# Altium schematic sheet ART-Pi_H750_Peripherals.SchDoc: STM32H750XB_Peripherals
size A3; DocumentNumber: 6; Revision: V1.5; SheetNumber: 6; SheetTotal: 11; PageSetup: Record=PageOptions|CenterHorizontal=True|CenterVertical=True|PrintScale=1.01|XCorrection=1.00|YCorrection=1.00|PrintKind=0|BorderSize=5000000|LeftOffset=0|BottomOffset=0|Orientation=2|PaperLength=1000|PaperWidth=1000|Scale=100|PaperSource=7|PrintQuality=600|MediaType=1|DitherType=10|PrintScaleMode=1|PaperKind=A3(297x420mm)|PaperIndex=8
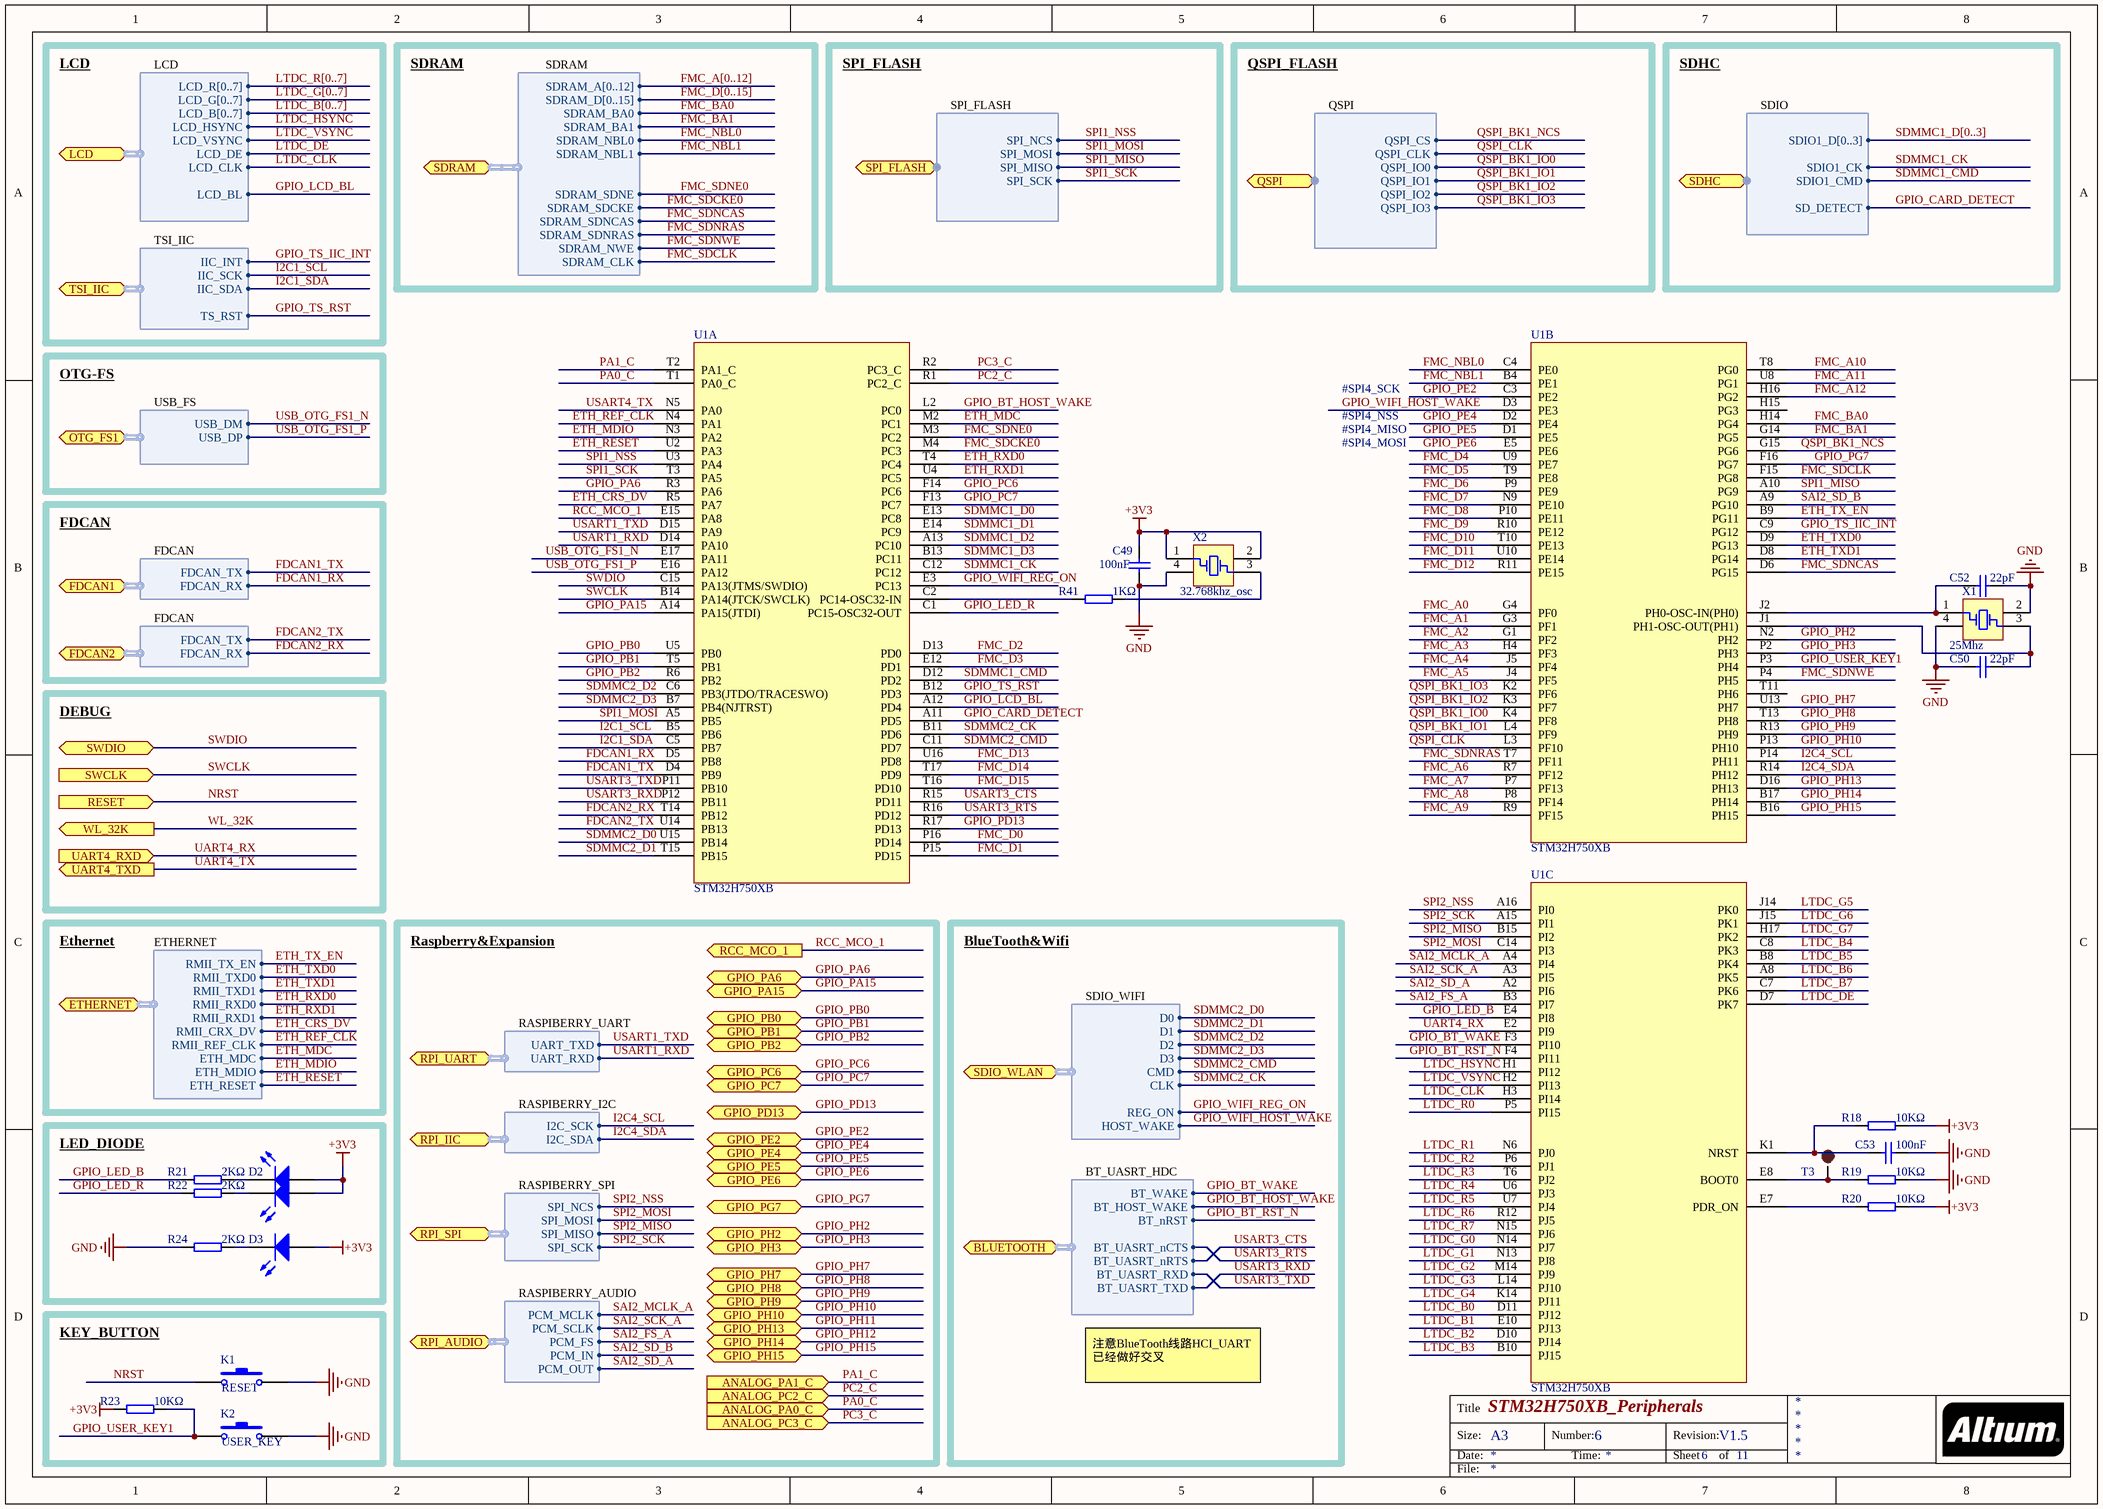
[diagram p0: ART-Pi_H750_Peripherals.SchDoc]

## Parts
C49  100nF  [0402_C]
C50  22pF  [0402_C]
C52  22pF  [0402_C]
C53  100nF  [0402_C]
D2  LED2  [LED2-0603]  (value not drawn)
D3  LED  [0603_LED]  (value not drawn)
K1  RESET  [SW-SMD]
K2  USER_KEY  [SW-SMD]
R18  10KΩ  [0402_R]
R19  10KΩ  [0402_R]
R20  10KΩ  [0402_R]
R21  2KΩ  [0402_R]
R22  2KΩ  [0402_R]
R23  10KΩ  [0402_R]
R24  2KΩ  [0402_R]
R41  1KΩ  [0402_R]
T3  TEST POINT  [Test_Point]  (value not drawn)
U1  STM32H750XB  [TFBGA240+25]  (parts A,B,C of 4)
X1  25Mhz  [SMD2520]
X2  32.768khz_osc  [SMD2520]

## Blocks framed on the sheet
LED_DIODE: D2 D3 R21 R22 R24
KEY_BUTTON: K1 K2 R23

## Ports
ANALOG_PA0_C (in), ANALOG_PA1_C (in), ANALOG_PC2_C (in), ANALOG_PC3_C (in), BLUETOOTH (harness Harness), ETHERNET (harness Harness), FDCAN1 (harness Harness), FDCAN2 (harness Harness), GPIO_PA6 (bidir), GPIO_PA15 (bidir), GPIO_PB0 (bidir), GPIO_PB1 (bidir), GPIO_PB2 (bidir), GPIO_PC6 (bidir), GPIO_PC7 (bidir), GPIO_PD13 (bidir), GPIO_PE2 (bidir), GPIO_PE4 (bidir), GPIO_PE5 (bidir), GPIO_PE6 (bidir), GPIO_PG7 (bidir), GPIO_PH2 (bidir), GPIO_PH3 (bidir), GPIO_PH7 (bidir), GPIO_PH8 (bidir), GPIO_PH9 (bidir), GPIO_PH10 (bidir), GPIO_PH13 (bidir), GPIO_PH14 (bidir), GPIO_PH15 (bidir), LCD (harness Harness), OTG_FS1 (harness Harness), QSPI (harness Harness), RCC_MCO_1 (out), RESET (in), RPI_AUDIO (harness Harness), RPI_IIC (harness Harness), RPI_SPI (harness Harness), RPI_UART (harness Harness), SDHC (harness Harness), SDIO_WLAN (harness Harness), SDRAM (harness Harness), SPI_FLASH (harness Harness), SWCLK (in), SWDIO (bidir), TSI_IIC (harness Harness), UART4_RXD (in), UART4_TXD (out), WL_32K (out)

## Harnesses
Harness: IIC_INT, IIC_SCK, IIC_SDA, TS_RST
Harness: LCD_G[0..7], LCD_B[0..7], LCD_HSYNC, LCD_VSYNC, LCD_DE, LCD_CLK, LCD_BL, LCD_R[0..7]
Harness: SDRAM_A[0..12], SDRAM_D[0..15], SDRAM_BA0, SDRAM_BA1, SDRAM_NBL0, SDRAM_NBL1, SDRAM_SDNE, SDRAM_SDCKE, SDRAM_SDNCAS, SDRAM_SDNRAS, SDRAM_NWE, SDRAM_CLK
Harness: SPI_NCS, SPI_MOSI, SPI_MISO, SPI_SCK
Harness: QSPI_CS, QSPI_CLK, QSPI_IO0, QSPI_IO1, QSPI_IO2, QSPI_IO3
Harness: SD_DETECT, SDIO1_D[0..3], SDIO1_CMD, SDIO1_CK
Harness: USB_DM, USB_DP
Harness: FDCAN_TX, FDCAN_RX
Harness: RMII_TX_EN, RMII_TXD0, RMII_TXD1, RMII_RXD0, RMII_RXD1, RMII_CRX_DV, RMII_REF_CLK, ETH_MDC, ETH_MDIO, ETH_RESET
Harness: UART_TXD, UART_RXD
Harness: I2C_SCK, I2C_SDA
Harness: PCM_MCLK, PCM_SCLK, PCM_FS, PCM_IN, PCM_OUT
Harness: D0, D1, D2, D3, CMD, CLK, REG_ON, HOST_WAKE
Harness: BT_WAKE, BT_HOST_WAKE, BT_nRST, BT_UASRT_nCTS, BT_UASRT_nRTS, BT_UASRT_RXD, BT_UASRT_TXD

## Nets
+3V3: C49.2 D2.1 D2.4 D3.1(A) R18.1 R20.1 R23.2 X2.1(OSC1) X2.2(OSC2)
GND: C49.1 C50.2 C52.1 C53.1 K1.2 K2.2 R19.1 R24.2 X1.2(OSC2) X1.4 X2.4
ETH_CRS_DV: U1.R5(PA7) ; port ETHERNET.RMII_CRX_DV
ETH_MDC: U1.M2(PC1) ; port ETHERNET.ETH_MDC
ETH_MDIO: U1.N3(PA2) ; port ETHERNET.ETH_MDIO
ETH_REF_CLK: U1.N4(PA1) ; port ETHERNET.RMII_REF_CLK
ETH_RESET: U1.U2(PA3) ; port ETHERNET.ETH_RESET
ETH_RXD0: U1.T4(PC4) ; port ETHERNET.RMII_RXD0
ETH_RXD1: U1.U4(PC5) ; port ETHERNET.RMII_RXD1
ETH_TX_EN: U1.B9(PG11) ; port ETHERNET.RMII_TX_EN
ETH_TXD0: U1.D9(PG13) ; port ETHERNET.RMII_TXD0
ETH_TXD1: U1.D8(PG14) ; port ETHERNET.RMII_TXD1
FDCAN1_RX: U1.D5(PB8) ; port FDCAN1.FDCAN_RX
FDCAN1_TX: U1.D4(PB9) ; port FDCAN1.FDCAN_TX
FDCAN2_RX: U1.T14(PB12) ; port FDCAN2.FDCAN_RX
FDCAN2_TX: U1.U14(PB13) ; port FDCAN2.FDCAN_TX
FMC_A0: U1.G4(PF0)
FMC_A1: U1.G3(PF1)
FMC_A2: U1.G1(PF2)
FMC_A3: U1.H4(PF3)
FMC_A4: U1.J5(PF4)
FMC_A5: U1.J4(PF5)
FMC_A6: U1.R7(PF12)
FMC_A7: U1.P7(PF13)
FMC_A8: U1.P8(PF14)
FMC_A9: U1.R9(PF15)
FMC_A10: U1.T8(PG0)
FMC_A11: U1.U8(PG1)
FMC_A12: U1.H16(PG2)
FMC_BA0: U1.H14(PG4) ; port SDRAM.SDRAM_BA0
FMC_BA1: U1.G14(PG5) ; port SDRAM.SDRAM_BA1
FMC_D0: U1.P16(PD14)
FMC_D1: U1.P15(PD15)
FMC_D2: U1.D13(PD0)
FMC_D3: U1.E12(PD1)
FMC_D4: U1.U9(PE7)
FMC_D5: U1.T9(PE8)
FMC_D6: U1.P9(PE9)
FMC_D7: U1.N9(PE10)
FMC_D8: U1.P10(PE11)
FMC_D9: U1.R10(PE12)
FMC_D10: U1.T10(PE13)
FMC_D11: U1.U10(PE14)
FMC_D12: U1.R11(PE15)
FMC_D13: U1.U16(PD8)
FMC_D14: U1.T17(PD9)
FMC_D15: U1.T16(PD10)
FMC_NBL0: U1.C4(PE0) ; port SDRAM.SDRAM_NBL0
FMC_NBL1: U1.B4(PE1) ; port SDRAM.SDRAM_NBL1
FMC_SDCKE0: U1.M4(PC3) ; port SDRAM.SDRAM_SDCKE
FMC_SDCLK: U1.F15(PG8) ; port SDRAM.SDRAM_CLK
FMC_SDNCAS: U1.D6(PG15) ; port SDRAM.SDRAM_SDNCAS
FMC_SDNE0: U1.M3(PC2) ; port SDRAM.SDRAM_SDNE
FMC_SDNRAS: U1.T7(PF11) ; port SDRAM.SDRAM_SDNRAS
FMC_SDNWE: U1.P4(PH5) ; port SDRAM.SDRAM_NWE
GPIO_BT_HOST_WAKE: U1.L2(PC0) ; port BLUETOOTH.BT_HOST_WAKE
GPIO_BT_RST_N: U1.F4(PI11) ; port BLUETOOTH.BT_nRST
GPIO_BT_WAKE: U1.F3(PI10) ; port BLUETOOTH.BT_WAKE
GPIO_CARD_DETECT: U1.A11(PD5) ; port SDHC.SD_DETECT
GPIO_LCD_BL: U1.A12(PD4) ; port LCD.LCD_BL
GPIO_LED_B: R21.2 U1.E4(PI8)
GPIO_LED_R: R22.2 U1.C1(PC15-OSC32-OUT)
GPIO_PA6: U1.R3(PA6) ; port GPIO_PA6
GPIO_PA15: U1.A14(PA15(JTDI)) ; port GPIO_PA15
GPIO_PB0: U1.U5(PB0) ; port GPIO_PB0
GPIO_PB1: U1.T5(PB1) ; port GPIO_PB1
GPIO_PB2: U1.R6(PB2) ; port GPIO_PB2
GPIO_PC6: U1.F14(PC6) ; port GPIO_PC6
GPIO_PC7: U1.F13(PC7) ; port GPIO_PC7
GPIO_PD13: U1.R17(PD13) ; port GPIO_PD13
GPIO_PE2: U1.C3(PE2) ; port GPIO_PE2
GPIO_PE4: U1.D2(PE4) ; port GPIO_PE4
GPIO_PE5: U1.D1(PE5) ; port GPIO_PE5
GPIO_PE6: U1.E5(PE6) ; port GPIO_PE6
GPIO_PG7: U1.F16(PG7) ; port GPIO_PG7
GPIO_PH2: U1.N2(PH2) ; port GPIO_PH2
GPIO_PH3: U1.P2(PH3) ; port GPIO_PH3
GPIO_PH7: U1.U13(PH7) ; port GPIO_PH7
GPIO_PH8: U1.T13(PH8) ; port GPIO_PH8
GPIO_PH9: U1.R13(PH9) ; port GPIO_PH9
GPIO_PH10: U1.P13(PH10) ; port GPIO_PH10
GPIO_PH11: port GPIO_PH13
GPIO_PH12: port GPIO_PH14
GPIO_PH13: U1.D16(PH13)
GPIO_PH14: U1.B17(PH14)
GPIO_PH15: U1.B16(PH15) ; port GPIO_PH15
GPIO_TS_IIC_INT: U1.C9(PG12) ; port TSI_IIC.IIC_INT
GPIO_TS_RST: U1.B12(PD3) ; port TSI_IIC.TS_RST
GPIO_USER_KEY1: K2.1 R23.1 U1.P3(PH4)
GPIO_WIFI_HOST_WAKE: U1.D3(PE3) ; port SDIO_WLAN.HOST_WAKE
GPIO_WIFI_REG_ON: U1.E3(PC13) ; port SDIO_WLAN.REG_ON
I2C1_SCL: U1.B5(PB6) ; port TSI_IIC.IIC_SCK
I2C1_SDA: U1.C5(PB7) ; port TSI_IIC.IIC_SDA
I2C4_SCL: U1.P14(PH11) ; port RPI_IIC.I2C_SCK
I2C4_SDA: U1.R14(PH12) ; port RPI_IIC.I2C_SDA
LTDC_B0: U1.D11(PJ12)
LTDC_B1: U1.E10(PJ13)
LTDC_B2: U1.D10(PJ14)
LTDC_B3: U1.B10(PJ15)
LTDC_B4: U1.C8(PK3)
LTDC_B5: U1.B8(PK4)
LTDC_B6: U1.A8(PK5)
LTDC_B7: U1.C7(PK6)
LTDC_CLK: U1.H3(PI14) ; port LCD.LCD_CLK
LTDC_DE: U1.D7(PK7) ; port LCD.LCD_DE
LTDC_G0: U1.N14(PJ7)
LTDC_G1: U1.N13(PJ8)
LTDC_G2: U1.M14(PJ9)
LTDC_G3: U1.L14(PJ10)
LTDC_G4: U1.K14(PJ11)
LTDC_G5: U1.J14(PK0)
LTDC_G6: U1.J15(PK1)
LTDC_G7: U1.H17(PK2)
LTDC_HSYNC: U1.H1(PI12) ; port LCD.LCD_HSYNC
LTDC_R0: U1.P5(PI15)
LTDC_R1: U1.N6(PJ0)
LTDC_R2: U1.P6(PJ1)
LTDC_R3: U1.T6(PJ2)
LTDC_R4: U1.U6(PJ3)
LTDC_R5: U1.U7(PJ4)
LTDC_R6: U1.R12(PJ5)
LTDC_R7: U1.N15(PJ6)
LTDC_VSYNC: U1.H2(PI13) ; port LCD.LCD_VSYNC
NRST: K1.1 ; port RESET
PA0_C: U1.T1(PA0_C) ; port ANALOG_PA0_C
PA1_C: U1.T2(PA1_C) ; port ANALOG_PA1_C
PC2_C: U1.R1(PC2_C) ; port ANALOG_PC2_C
PC3_C: U1.R2(PC3_C) ; port ANALOG_PC3_C
QSPI_BK1_IO0: U1.K4(PF8) ; port QSPI.QSPI_IO0
QSPI_BK1_IO1: U1.L4(PF9) ; port QSPI.QSPI_IO1
QSPI_BK1_IO2: U1.K3(PF7) ; port QSPI.QSPI_IO2
QSPI_BK1_IO3: U1.K2(PF6) ; port QSPI.QSPI_IO3
QSPI_BK1_NCS: U1.G15(PG6) ; port QSPI.QSPI_CS
QSPI_CLK: U1.L3(PF10) ; port QSPI.QSPI_CLK
RCC_MCO_1: U1.E15(PA8) ; port RCC_MCO_1
SAI2_FS_A: U1.B3(PI7) ; port RPI_AUDIO.PCM_FS
SAI2_MCLK_A: U1.A4(PI4) ; port RPI_AUDIO.PCM_MCLK
SAI2_SCK_A: U1.A3(PI5) ; port RPI_AUDIO.PCM_SCLK
SAI2_SD_A: U1.A2(PI6) ; port RPI_AUDIO.PCM_OUT
SAI2_SD_B: U1.A9(PG10) ; port RPI_AUDIO.PCM_IN
SDMMC1_CK: U1.C12(PC12) ; port SDHC.SDIO1_CK
SDMMC1_CMD: U1.D12(PD2) ; port SDHC.SDIO1_CMD
SDMMC1_D0: U1.E13(PC8)
SDMMC1_D1: U1.E14(PC9)
SDMMC1_D2: U1.A13(PC10)
SDMMC1_D3: U1.B13(PC11)
SDMMC2_CK: U1.B11(PD6) ; port SDIO_WLAN.CLK
SDMMC2_CMD: U1.C11(PD7) ; port SDIO_WLAN.CMD
SDMMC2_D0: U1.U15(PB14) ; port SDIO_WLAN.D0
SDMMC2_D1: U1.T15(PB15) ; port SDIO_WLAN.D1
SDMMC2_D2: U1.C6(PB3(JTDO/TRACESWO)) ; port SDIO_WLAN.D2
SDMMC2_D3: U1.B7(PB4(NJTRST)) ; port SDIO_WLAN.D3
SPI1_MISO: U1.A10(PG9) ; port SPI_FLASH.SPI_MISO
SPI1_MOSI: U1.A5(PB5) ; port SPI_FLASH.SPI_MOSI
SPI1_NSS: U1.U3(PA4) ; port SPI_FLASH.SPI_NCS
SPI1_SCK: U1.T3(PA5) ; port SPI_FLASH.SPI_SCK
SPI2_MISO: U1.B15(PI2) ; port RPI_SPI.SPI_MISO
SPI2_MOSI: U1.C14(PI3) ; port RPI_SPI.SPI_MOSI
SPI2_NSS: U1.A16(PI0) ; port RPI_SPI.SPI_NCS
SPI2_SCK: U1.A15(PI1) ; port RPI_SPI.SPI_SCK
SWCLK: U1.B14(PA14(JTCK/SWCLK)) ; port SWCLK
SWDIO: U1.C15(PA13(JTMS/SWDIO)) ; port SWDIO
UART4_RX: U1.E2(PI9) ; port UART4_RXD
UART4_TX: port UART4_TXD
USART1_RXD: U1.D14(PA10) ; port RPI_UART.UART_RXD
USART1_TXD: U1.D15(PA9) ; port RPI_UART.UART_TXD
USART3_CTS: U1.R15(PD11) ; port BLUETOOTH.BT_UASRT_nRTS
USART3_RTS: U1.R16(PD12) ; port BLUETOOTH.BT_UASRT_nCTS
USART3_RXD: U1.P12(PB11) ; port BLUETOOTH.BT_UASRT_TXD
USART3_TXD: U1.P11(PB10) ; port BLUETOOTH.BT_UASRT_RXD
USART4_TX: U1.N5(PA0)
USB_OTG_FS1_N: U1.E17(PA11) ; port OTG_FS1.USB_DM
USB_OTG_FS1_P: U1.E16(PA12) ; port OTG_FS1.USB_DP
WL_32K: port WL_32K
NetC50_1: C50.1 U1.J1(PH1-OSC-OUT(PH1)) X1.3
NetC52_2: C52.2 U1.J2(PH0-OSC-IN(PH0)) X1.1(OSC1)
NetC53_2: C53.2 R18.2 U1.K1(NRST)
NetD2_2: D2.2 R22.1
NetD2_3: D2.3 R21.1
NetD3_2: D3.2(K) R24.1
NetR19_2: R19.2 T3.1 U1.E8(BOOT0)
NetR20_2: R20.2 U1.E7(PDR_ON)
NetR41_1: R41.1 X2.3
NetR41_2: R41.2 U1.C2(PC14-OSC32-IN)

Not connected (* = marked no-connect by the designer): U1 H15(PG3) T11(PH6)

## Buses and harness runs
bus FMC_A[0..12]
bus FMC_D[0..15]
bus LTDC_B[0..7]
bus LTDC_G[0..7]
bus LTDC_R[0..7]
bus SDMMC1_D[0..3]

## Notes on the sheet
- LCD
- SDRAM
- SPI_FLASH
- QSPI_FLASH
- QSPI
- SDHC
- SDIO
- TSI_IIC
- OTG-FS
- USB_FS
- #SPI4_SCK
- #SPI4_NSS
- #SPI4_MISO
- #SPI4_MOSI
- FDCAN
- DEBUG
- Ethernet
- ETHERNET
- Raspberry&Expansion
- BlueTooth&Wifi
- RASPIBERRY_UART
- SDIO_WIFI
- RASPIBERRY_I2C
- RASPIBERRY_SPI
- BT_UASRT_HDC
- RASPIBERRY_AUDIO
- 注意BlueTooth线路HCI_UART已经做好交叉
- Title
- Size:
- Date:
- A3
- Number:
- Time:
- Revision:
- Sheet
- of
- File:

## Library data of the parts
C49 C50 C52 C53 = Cap: Capacitor; Published: 8-Jun-2000; LatestRevisionDate: 17-Jul-2002; LatestRevisionNote: Re-released for DXP Platform.; PackageReference: RAD-0.3; Publisher: Altium Limited; PackageDescription: Radial Cap, Thru-Hole; 2 Leads; 0.3 in Pin Spacing
D2 = LED2: Typical RED, GREEN, YELLOW, AMBER GaAs LED; Published: 8-Jun-2000; LatestRevisionDate: 17-Jul-2002; LatestRevisionNote: Re-released for DXP Platform.; PackageVersion: Feb-2002; PackageReference: 3.2X1.6X1.1; Publisher: Altium Limited; PackageDescription: SM LED; 2 Flat Leads
D3 = LED: Typical RED, GREEN, YELLOW, AMBER GaAs LED; Published: 8-Jun-2000; LatestRevisionDate: 17-Jul-2002; LatestRevisionNote: Re-released for DXP Platform.; PackageVersion: Feb-2002; PackageReference: 3.2X1.6X1.1; Publisher: Altium Limited; PackageDescription: SM LED; 2 Flat Leads
K1 K2 = SW_PB: Switch; Published: 24-Mar-1999; LatestRevisionDate: 17-Jul-2002; LatestRevisionNote: Re-released for DXP Platform.; PackageReference: SPST-2; Publisher: Altium Limited; PackageDescription: Switch; 2 Leads
R18-R24 R41 = Res: Resister
T3 = TEST-POINT: 测试点
X1 X2 = XTAL_3225: Crystal Oscillator; Published: 8-Jun-2000; LatestRevisionDate: 17-Jul-2002; LatestRevisionNote: Re-released for DXP Platform.; PackageReference: R38; Publisher: Altium Limited; PackageDescription: Crystal, Thru-Hole; 2 Leads; Body 3.1 x 8.2 mm (Dia.xH)